# EAGLE schematic Blinky (EAGLE 8.6.0)
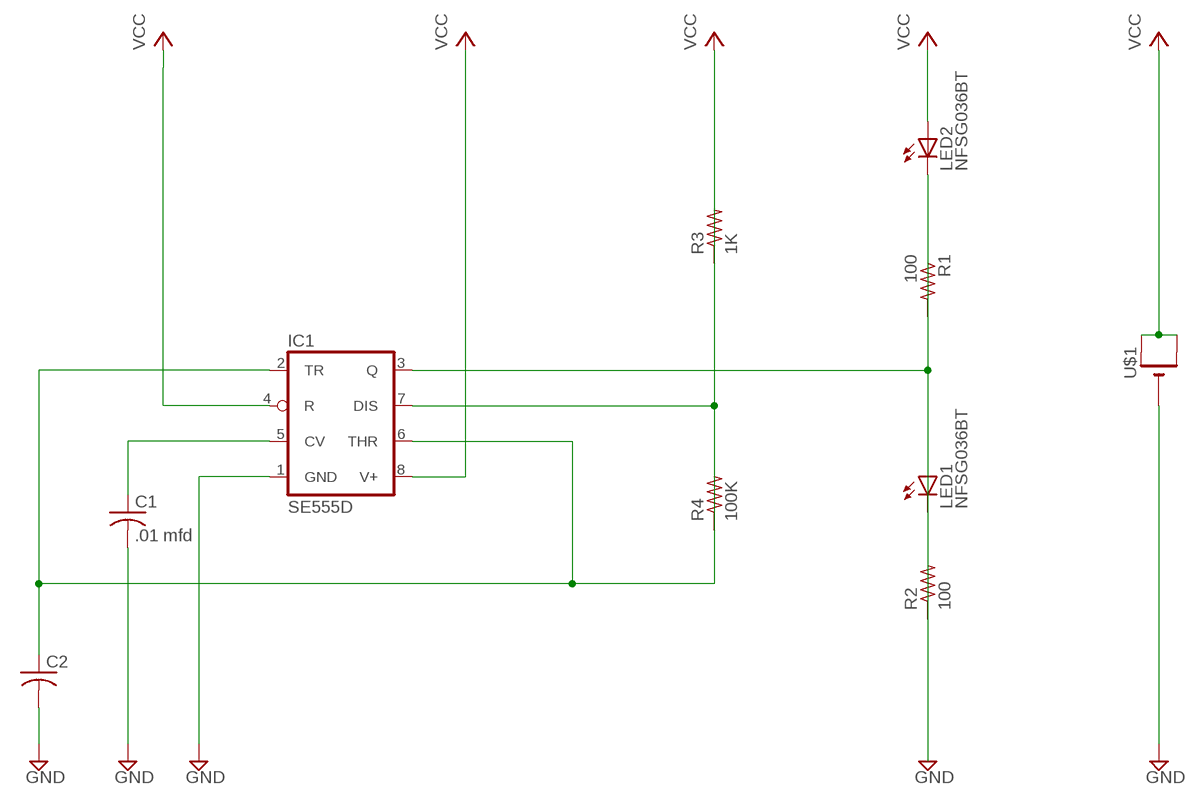
[diagram p0: schematic, sheet 1]

## Parts
C1  .01 mfd  C-USC0805  [C0805]
C2  C-USC0805  [C0805]
IC1  SE555D  [SO08]
LED1  NFSG036BT  [NFSG036BT]
LED2  NFSG036BT  [NFSG036BT]
R1  100  R-US_M0805  [M0805]
R2  100  R-US_M0805  [M0805]
R3  1K  R-US_M0805  [M0805]
R4  100K  R-US_M0805  [M0805]
U$1  CR1220THM  [CR1220-THM]

## Nets
GND: C1.2 C2.2 IC1.1(GND) IC1.3(Q) LED2.C R2.1 U$1.-
N$1: C1.1 IC1.5(CV)
VCC: C2.1 IC1.2(TR) IC1.4(R) IC1.6(THR) IC1.7(DIS) IC1.8(V+) LED2.A U$1.+1(+) U$1.+2(+1)
Unconnected: LED1.A LED1.C R1.1 R1.2 R2.2 R3.1 R3.2 R4.1 R4.2

## Library data of the parts
C1 C2 = adafruit:C-US: CAPACITOR, American symbol
IC1 = linear:*555: TIMER
LED1 LED2 = led:NFSG036BT: CHIP TYPE GREEN LED NFSx036xT Source: NICHIA CORPORATION .. NFSG036BT-E.pdf
R1-R4 = resistor:R-US_: RESISTOR, American symbol
U$1 = adafruit:CR1220: CR1216/CR1220/CR1225 12mm 3V lithium coin cell Great for battery packup. Both SMT and THM holders. Note the THM package has the ground pads on both sides of the PCB so that the masks are the same - this reduces the cost